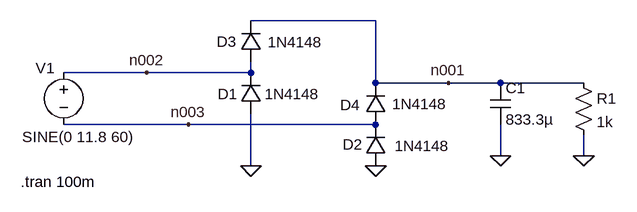
[diagram p0: schematic c01ex20s01.asc]
c01ex20s01.asc, the LTspice schematic file:
Version 4
SHEET 1 880 680
WIRE 464 -96 272 -96
WIRE 112 -16 -16 -16
WIRE 272 -16 272 -32
WIRE 272 -16 112 -16
WIRE 464 0 464 -96
WIRE 576 0 464 0
WIRE 656 0 576 0
WIRE 784 0 656 0
WIRE 176 64 -16 64
WIRE 464 64 176 64
WIRE 464 80 464 64
WIRE 656 112 656 64
WIRE 784 112 784 80
WIRE 272 128 272 48
FLAG 272 128 0
FLAG 464 128 0
FLAG 784 112 0
FLAG 656 112 0
FLAG 112 -16 n002
FLAG 576 0 n001
FLAG 176 64 n003
SYMBOL diode 288 48 R180
WINDOW 0 36 31 Left 2
WINDOW 3 -90 31 Left 2
SYMATTR InstName D1
SYMATTR Value 1N4148
SYMBOL voltage -16 -32 R0
WINDOW 0 -43 9 Left 2
WINDOW 3 -64 115 Left 2
WINDOW 123 0 0 Left 0
WINDOW 39 0 0 Left 0
SYMATTR InstName V1
SYMATTR Value SINE(0 11.8 60)
SYMBOL diode 480 128 R180
WINDOW 0 36 33 Left 2
WINDOW 3 -98 31 Left 2
SYMATTR InstName D2
SYMATTR Value 1N4148
SYMBOL diode 288 -32 R180
WINDOW 0 38 32 Left 2
WINDOW 3 -95 31 Left 2
SYMATTR InstName D3
SYMATTR Value 1N4148
SYMBOL diode 480 64 R180
WINDOW 0 40 30 Left 2
WINDOW 3 -94 32 Left 2
SYMATTR InstName D4
SYMATTR Value 1N4148
SYMBOL res 768 -16 R0
SYMATTR InstName R1
SYMATTR Value 1k
SYMBOL cap 640 0 R0
SYMATTR InstName C1
SYMATTR Value 833.3µ
TEXT -82 152 Left 2 !.tran 100m

The netlist it stands for:
* c01ex20s01.asc
D1 0 n002 1N4148
V1 n002 n003 SINE(0 11.8 60)
D2 0 n003 1N4148
D3 n002 n001 1N4148
D4 n003 n001 1N4148
R1 n001 0 1k
C1 n001 0 833.3µ
.model D D
.lib standard.dio
.tran 100m
.backanno
.end